# Altium project Dot_Matrix.PrjPcb
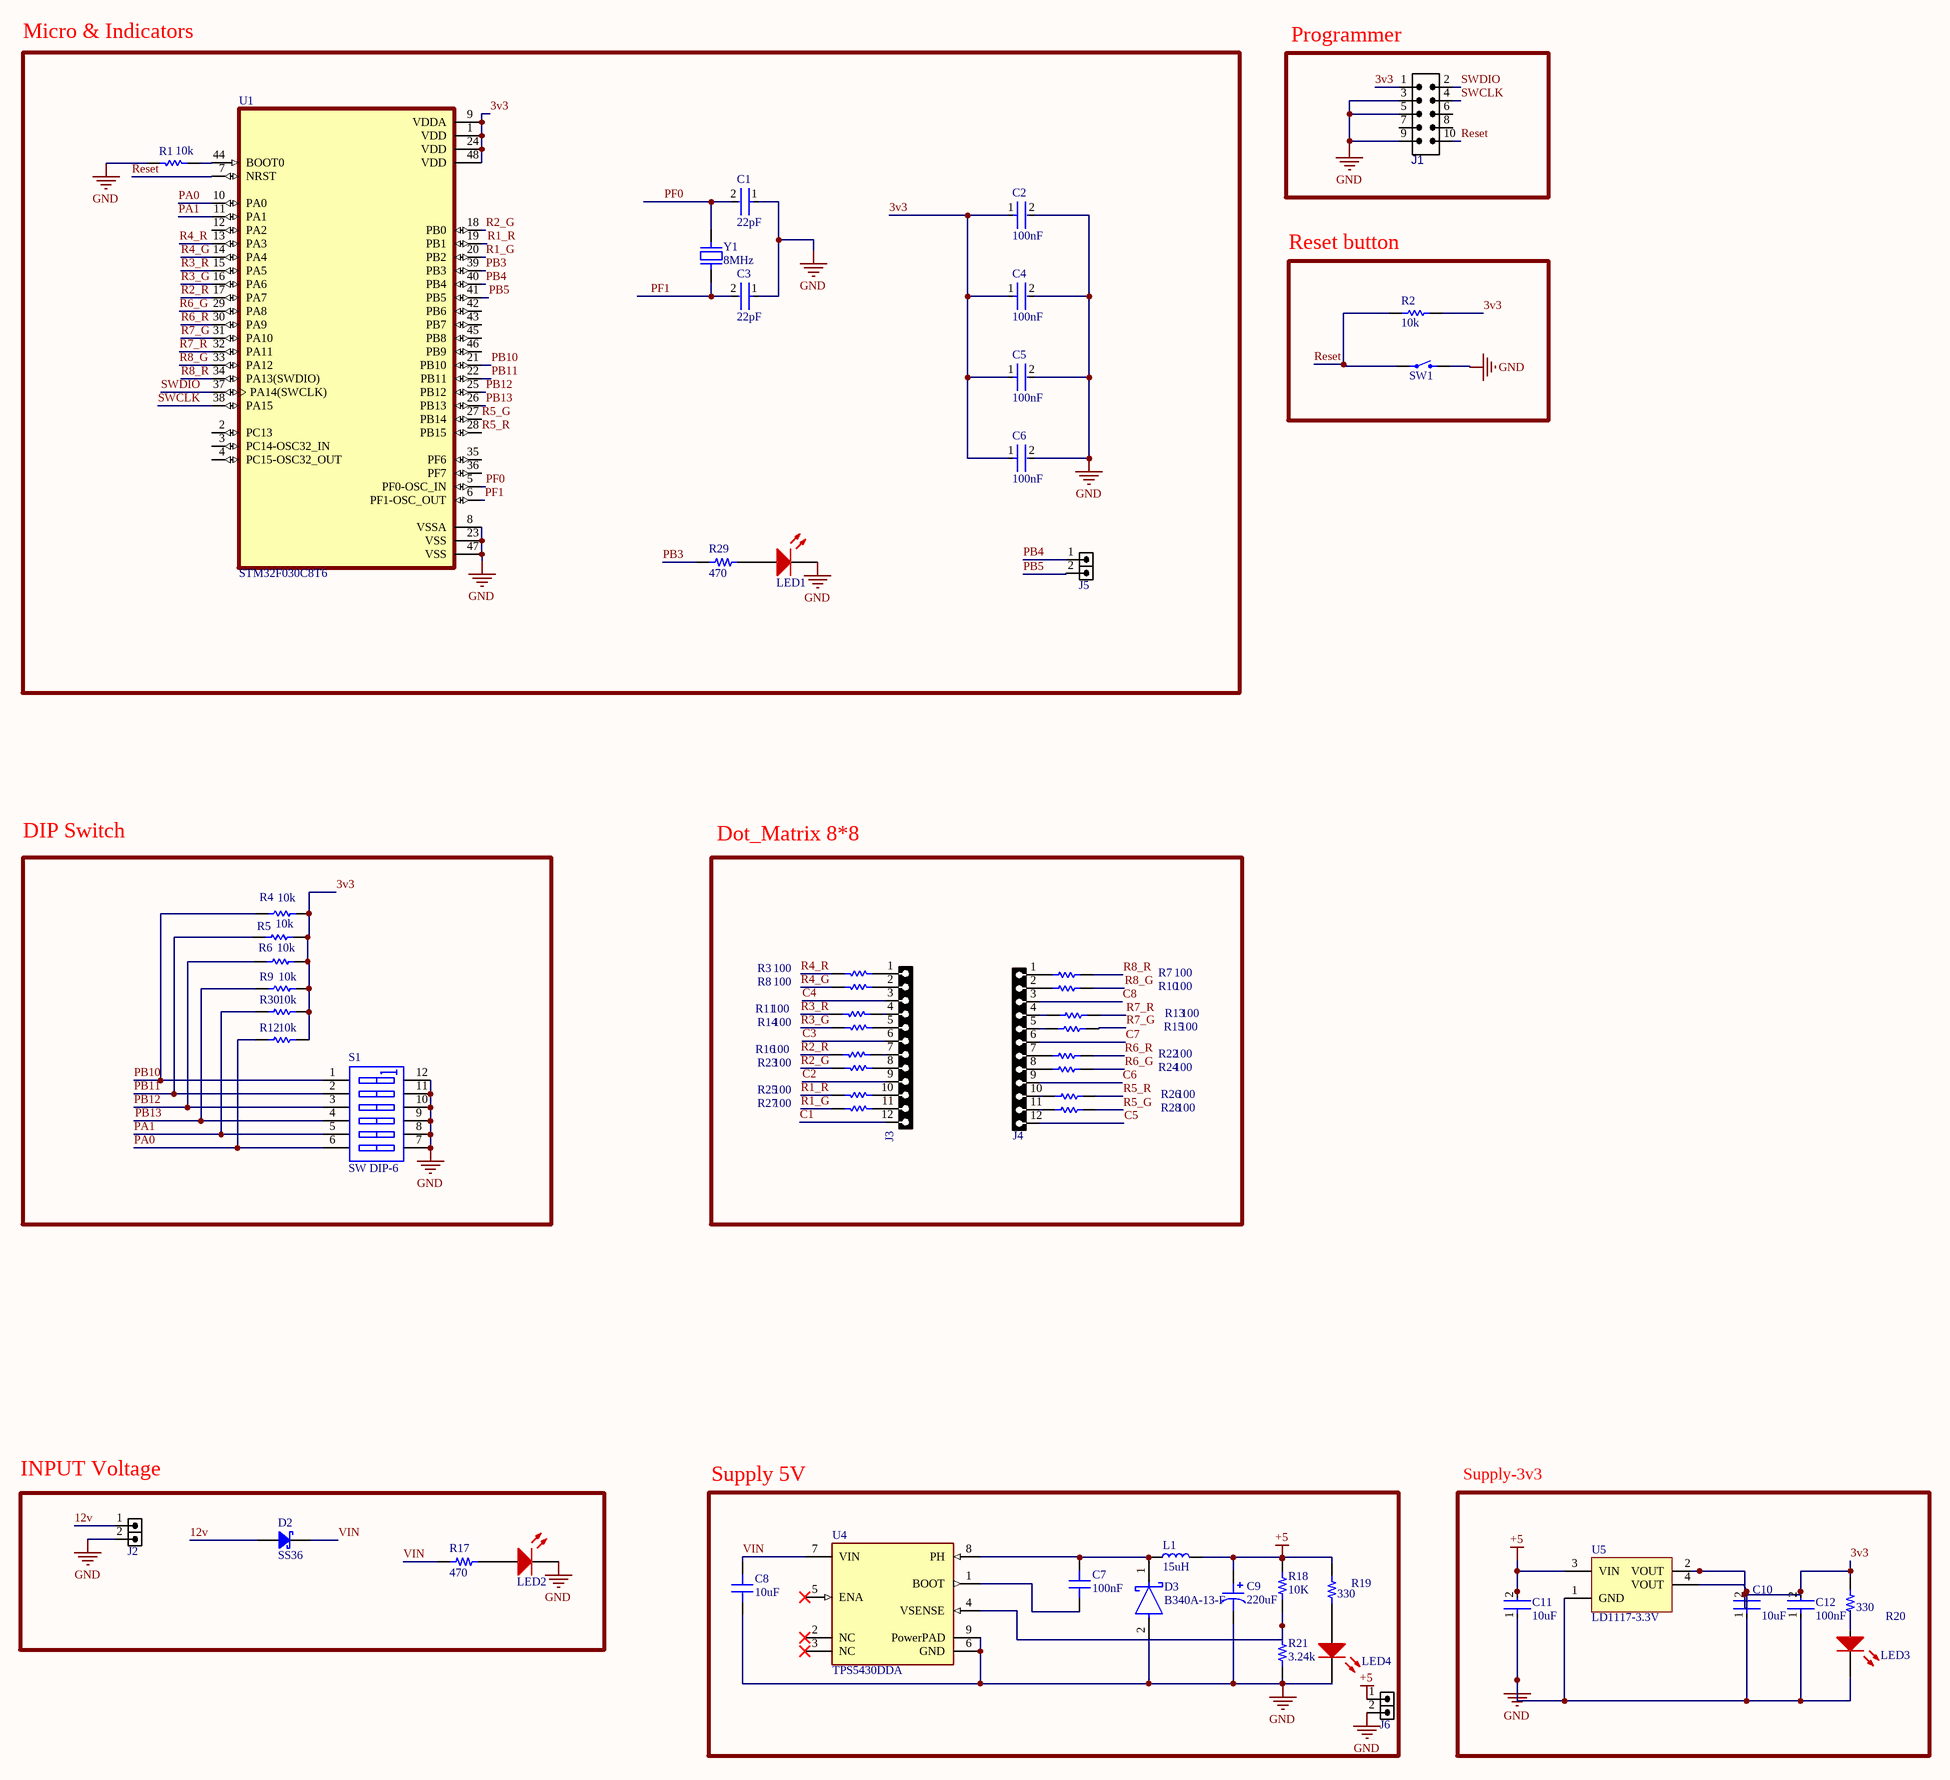
[diagram p0: Dot_Matrix.SchDoc]
1 sheet, 61 parts. Net scope: global (net labels, ports and power ports of the same name join across sheets).
Board file: Dot_Matrix.PcbDoc

## Sheet Dot_Matrix.SchDoc
size A2

### Parts
C1  22pF  [FP-C0805C-DN-MFG]
C2  100nF  [FP-C0805C-DN-MFG]
C3  22pF  [FP-C0805C-DN-MFG]
C4  100nF  [FP-C0805C-DN-MFG]
C5  100nF  [FP-C0805C-DN-MFG]
C6  100nF  [FP-C0805C-DN-MFG]
C7  100nF  [CAP 0805_2012]
C8  10uF  [CAP 0805_2012]
C9  220uF  [CAP TANSMD 1206_3216 CASE A]
C10  10uF  [FP-C0805C-DN-MFG]
C11  10uF  [FP-C0805C-DN-MFG]
C12  100nF  [FP-C0805C-DN-MFG]
D2  SS36  [DO-214AA SMB]
D3  B340A-13-F  [FP-SMA-MFG]
J1  IDC_2X5  [IDC_2X5]  (value not drawn)
J2  HDRM2  [HDR_1X2]  (value not drawn)
J3  HDRF12  [HDR_F_1X12]  (value not drawn)
J4  HDRF12  [HDR_F_1X12]  (value not drawn)
J5  HDRM2  [HDR_1X2]  (value not drawn)
J6  HDRM2  [HDR_1X2]  (value not drawn)
L1  15uH  [IND 0805_2012]
LED1  LED SMD 0805 RED  [LED_0805_RED]  (value not drawn)
LED2  LED SMD 0805 RED  [LED_0805_RED]  (value not drawn)
LED3  LED SMD 0805 RED  [LED_0805_RED]  (value not drawn)
LED4  LED SMD 0805 RED  [LED_0805_RED]  (value not drawn)
R1  10k  [RESC2013X60X35ML10T20]
R2  10k  [RESC2013X60X35ML10T20]
R3  100  [RESC2013X60X35ML10T20]
R4  10k  [RESC2013X60X35ML10T20]
R5  10k  [RESC2013X60X35ML10T20]
R6  10k  [RESC2013X60X35ML10T20]
R7  100  [RESC2013X60X35ML10T20]
R8  100  [RESC2013X60X35ML10T20]
R9  10k  [RESC2013X60X35ML10T20]
R10  100  [RESC2013X60X35ML10T20]
R11  100  [RESC2013X60X35ML10T20]
R12  10k  [RESC2013X60X35ML10T20]
R13  100  [RESC2013X60X35ML10T20]
R14  100  [RESC2013X60X35ML10T20]
R15  100  [RESC2013X60X35ML10T20]
R16  100  [RESC2013X60X35ML10T20]
R17  470  [RES 0805_2012]
R18  10K  [RES 0805_2012]
R19  330  [RES 0805_2012]
R20  330  [RES 0805_2012]
R21  3.24k  [RES 0805_2012]
R22  100  [RESC2013X60X35ML10T20]
R23  100  [RESC2013X60X35ML10T20]
R24  100  [RESC2013X60X35ML10T20]
R25  100  [RESC2013X60X35ML10T20]
R26  100  [RESC2013X60X35ML10T20]
R27  100  [RESC2013X60X35ML10T20]
R28  100  [RESC2013X60X35ML10T20]
R29  470  [RES 0805_2012]
R30  10k  [RESC2013X60X35ML10T20]
S1  SW DIP-6  [DIP-12/SW]
SW1  Tactile 2PIN 6X3.5mm H4.57mm (SMD)  [SWPBS_SPST_6X3X5]  (value not drawn)
U1  STM32F030C8T6  [QFP50P900X900X160-48N]
U4  TPS5430DDA  [FP-DDA0008J-MFG]
U5  LD1117-3.3V  [SOT-223-4 6.5X7MM P2.3MM]
Y1  8MHz  [HC-49S SMD]

### Blocks framed on the sheet
Micro & Indicators: C1-C6 J5 LED1 R1 R29 U1 Y1
Programmer: J1
Reset button: R2 SW1
DIP Switch: R4-R6 R9 R12 R30 S1
Dot_Matrix 8*8: J3 J4 R3 R7 R8 R10 R11 R13-R16 R22-R28
INPUT Voltage: D2 J2 LED2 R17
Supply 5V: C7-C9 D3 J6 L1 LED4 R18 R19 R21 U4
Supply-3v3: C10-C12 LED3 R20 U5

### Nets
+5: C9.1 C11.2 J6.1 L1.2 R18.2 R19.1 U5.3(VIN)
GND: C1.1 C2.2 C3.1 C4.2 C5.2 C6.2 C8.1 C9.2 C10.1 C11.1 C12.1 D3.2(A) J1.3 J1.5 J1.9 J2.2 J6.2 LED1.2(K) LED2.2(K) LED3.2(K) LED4.2(K) R1.1 R21.1 S1.7(B6) S1.8(B5) S1.9(B4) S1.10(B3) S1.11(B2) S1.12(B1) SW1.2 U1.8(VSSA) U1.23(VSS) U1.47(VSS) U4.6(GND) U4.9(PowerPAD) U5.1(GND)
3v3: C2.1 C4.1 C5.1 C6.1 C10.2 C12.2 J1.1 R2.1 R4.1 R5.1 R6.1 R9.1 R12.1 R20.1 R30.1 U1.1(VDD) U1.9(VDDA) U1.24(VDD) U1.48(VDD) U5.2(VOUT) U5.4(VOUT)
12v: D2.1 J2.1
C1: J3.12
C2: J3.9
C3: J3.6
C4: J3.3
C5: J4.12
C6: J4.9
C7: J4.6
C8: J4.3
PA0: R12.2 S1.6(A6) U1.10(PA0)
PA1: R30.2 S1.5(A5) U1.11(PA1)
PB3: R29.1 U1.39(PB3)
PB4: J5.1 U1.40(PB4)
PB5: J5.2 U1.41(PB5)
PB10: R4.2 S1.1(A1) U1.21(PB10)
PB11: R5.2 S1.2(A2) U1.22(PB11)
PB12: R6.2 S1.3(A3) U1.25(PB12)
PB13: R9.2 S1.4(A4) U1.26(PB13)
PF0: C1.2 U1.5(PF0-OSC_IN) Y1.2
PF1: C3.2 U1.6(PF1-OSC_OUT) Y1.1
R1_G: R27.1 U1.20(PB2)
R1_R: R25.1 U1.19(PB1)
R2_G: R23.1 U1.18(PB0)
R2_R: R16.1 U1.17(PA7)
R3_G: R14.1 U1.16(PA6)
R3_R: R11.1 U1.15(PA5)
R4_G: R8.1 U1.14(PA4)
R4_R: R3.1 U1.13(PA3)
R5_G: R28.1 U1.27(PB14)
R5_R: R26.1 U1.28(PB15)
R6_G: R24.1 U1.29(PA8)
R6_R: R22.1 U1.30(PA9)
R7_G: R15.1 U1.31(PA10)
R7_R: R13.1 U1.32(PA11)
R8_G: R10.1 U1.33(PA12)
R8_R: R7.1 U1.34(PA13(SWDIO))
Reset: J1.10 R2.2 SW1.1 U1.7(NRST)
SWCLK: J1.4 U1.38(PA15)
SWDIO: J1.2 U1.37(PA14(SWCLK))
VIN: C8.2 D2.2 R17.1 U4.7(VIN)
NetC7_1: C7.1 U4.1(BOOT)
NetC7_2: C7.2 D3.1(C) L1.1 U4.8(PH)
NetJ3_1: J3.1 R3.2
NetJ3_2: J3.2 R8.2
NetJ3_4: J3.4 R11.2
NetJ3_5: J3.5 R14.2
NetJ3_7: J3.7 R16.2
NetJ3_8: J3.8 R23.2
NetJ3_10: J3.10 R25.2
NetJ3_11: J3.11 R27.2
NetJ4_1: J4.1 R7.2
NetJ4_2: J4.2 R10.2
NetJ4_4: J4.4 R13.2
NetJ4_5: J4.5 R15.2
NetJ4_7: J4.7 R22.2
NetJ4_8: J4.8 R24.2
NetJ4_10: J4.10 R26.2
NetJ4_11: J4.11 R28.2
NetLED1_1: LED1.1(A) R29.2
NetLED2_1: LED2.1(A) R17.2
NetLED3_1: LED3.1(A) R20.2
NetLED4_1: LED4.1(A) R19.2
NetR1_2: R1.2 U1.44(BOOT0)
NetR18_1: R18.1 R21.2 U4.4(VSENSE)

Not connected (* = marked no-connect by the designer): J1 6 7 8; U1 2(PC13) 3(PC14-OSC32_IN) 4(PC15-OSC32_OUT) 12(PA2) 35(PF6) 36(PF7) 42(PB6) 43(PB7) 45(PB8) 46(PB9); U4 2(NC)* 3(NC)* 5(ENA)*

### Notes on the sheet
- Title
- Size:
- Date:
- File:
- A2
- Number:
- Time:
- Revision:
- Sheet
- of

### Library data of the parts
C1-C6 C10-C12 = CMP-1036-04552-2: CAP CER 0.22UF 50V X7R 0805; Manufacturer: KEMET; Manufacturer Part Number: C0805C224K5RACTU; Value: 0.22 μF; Temperature Coefficient: 30ppm/°C; Material: Ceramic; Tolerance: 0.1; ComponentLink2URL: https://content.kemet.com/datasheets/KEM_C1003_C0G_SMD.pdf; Temperature Characteristic: X7R; Device Class L3: Ceramic Capacitors; Lead Free: Yes; Temperature: -55°C to +125°C; RoHS: TRUE; Capacitance: 0.22 μF; Automotive: No; Octopart: https://octopart.com/c0805c224k5ractu-kemet-144670; Temperature Range Low: -55°C; Height: 0.88mm; Device Class L1: Passive Components; Digikey Description: CAP CER 0.22UF 50V X7R 0805; ComponentLink2Description: Datasheet; Mouser Description: CAP CER 0.22UF 50V X7R 0805; Category: Cap; Ipc Land Pattern Name: CAPC200125X78; Temperature Range High: +125°C; Package: C0805C-DN; Device Class L2: Capacitors; Voltage Rating: 50 V
C7 = Cap 0805: SMT Capacitor; VALUE: 100nF
C8 = Cap 0805: SMT Capacitor; VALUE: 100nF
C9 = Cap Tan Case A: SMT Tantalum Capacitor; VALUE: 10uF 6.3V
D2 = SS36 (SMD SMC): Diode Schottky 60V 3A Surface Mount DO-214AB (SMC); PartNumber: SS36-E3/57T
D3 = CMP-1667-00003-3: DIODE SCHOTTKY 40V 3A SMA; Max Forward Surge Current (Ifsm): 80A; Forward Voltage: 500mV; Polarity: Standard; Max Reverse Current: 500uA; Capacitance: 250pF; Element Configuration: Single; Mount: Surface Mount; Output Current: 3A; Radiation Hardening: No; Width: 2.92mm; Current Rating: 3A; Termination: SMD/SMT; Voltage: 40V; Series: -; Max Operating Temperature: 125°C; Current: 3A; Max Repetitive Reverse Voltage (Vrrm): 40V; Min Operating Temperature: -55°C; REACH SVHC: No SVHC; Number of Pins: 2; Average Rectified Current: 3A; Contact Plating: Tin; RoHS Compliant: Yes; Max Reverse Voltage (DC): 40V; Packaging: Tape and Reel; Height: 2.3mm; Length: 4.6mm; Case/Package: SMA; Weight: 0.002258oz; Peak Non-Repetitive Surge Current: 80A; Package Quantity: 5000; Lead Free: Lead Free; Forward Current: 3A; Voltage Rating (DC): 40V
J1 = IDC_2X5: CONN, IDC, Male, pitch: 2.54mm, 10POS; VALUE: IDC_2X5
J2 J5 J6 = HDR_1X2: CONN, HEADER, Male, pitch: 2.54mm, 2POS; VALUE: HDRM2
J3 J4 = HDR_F_1X12: CONN, HEADER, Female, pitch: 2.54mm, 12POS; VALUE: HDRF12
L1 = Ind 0805: SMT Inductor; Value: 15uH
R1-R16 R22-R28 R30 = CMP-2100-03673-1: Chip Resistor, 0 Ohm, Jumper, +/- 5%, 0.125 W, -55 to 155 degC, 0805 (2012 Metric), RoHS, Tape and Reel; Manufacturer: Yageo; Power Rating: 125mW; Resistance: 0mOhm; Voltage Rating (DC): 150V; Temperature Coefficient: 200ppm/degreesC; Height: 0.5mm; Depth: 1.25mm; Case Code (Imperial): 0805; Lead Free: LeadFree; Military Standard: Not; Package Description: 2-Pin Surface Mounted Device, Body 2 x 1.25 mm; Case Code (Metric): 2012; Composition: ThickFilm; Voltage Rating: 150V; Manufacturer URL: http://www.yageo.com/; Packaging: TapeandReel; Package Reference: 0805; REACH SVHC: Unknown; Tolerance: 5%; Case/Package: 0805; Max Operating Temperature: 155degC; Number of Pins: 2; Min Operating Temperature: -55degC; RoHSCompliant: true; Length: 2mm; Datasheet URL: http://www.yageo.com/NewPortal/yageodocoutput?fileName=/pdf/R-Chip/PYu-RC_Group_51_RoHS_L_5.pdf; Termination: SMD/SMT; Radiation Hardening: No; Width: 1.25mm; Contact Plating: Tin; Datasheet Version: Rev. 5, 10/2016
R17-R21 R29 = Res 0805: SMT Resistor; VALUE: 1K
S1 = SW DIP-6: DIP Switch, 6 Position, SPST; Published: 24-Mar-1999; LatestRevisionDate: 17-Jul-2002; LatestRevisionNote: Re-released for DXP Platform.; PackageReference: DIP-12/SW; Publisher: Altium Limited; PackageDescription: DIP Switch; 12 Leads
SW1 = Tactile 2PIN 6X3.5mm H4.57mm (SMD): Tactile Switch SPST-NO Top Actuated Surface Mount; PartNumber: FSMSMTR-ND
U1 = STM32F030C8T6: STM32F Series 32-bit 64 kB Flash 8 kB RAM ARM Based Microcontroller - LQFP-48; Value: *; Availability: Unavailable; Price: None; MP: STM32F030C8T6; Package: None
U4 = CMP-2000-04960-2: IC REG BUCK ADJUSTABLE 3A 8SOPWR; Manufacturer: Texas Instruments; Max Junction Temp: +125°C; Max Supply Voltage: 36V; Switching Frequency: 500kHz; Output Type: AdjustableProgrammable; Standoff Height: 0mm; Output Voltage: 1.23-31V; Max Duty Cycle: 89%; Nominal Supply Current: 3mA; Min Supply Voltage: 5.5V; Number Of Outputs: 1; Temperature: -40°C to +125°C; Temperature Range High: +125°C; Manufacturer Part Number: TPS5430DDA; Device Class L3: Voltage Regulators - Switching; Mouser Description: Voltage Regulators - Switching Regulators 5.5 to 36V Input 3A Step Dwn Converter; Switching Topology: Buck; ComponentLink2URL: http://www.ti.com/lit/ds/symlink/tps5431.pdf; ComponentLink2Description: Datasheet; Device Class L2: Power Management ICs; Device Class L1: Integrated Circuits (ICs); Digikey Description: IC REG BUCK ADJUSTABLE 3A 8SOPWR; RoHS: TRUE; Octopart: https://octopart.com/tps5430dda-texas+instruments-589977; Output Current: 3A; Automotive: No; Lead Free: Yes; Category: IC; Package: DDA0008J; Temperature Range Low: -40°C; Height: 1.7mm
U5 = LD1117-3.3V (SMD SOT-223): Linear Voltage Regulator IC  1 Output  800mA SOT-223; PartNumber: LD1117S33CTR
Y1 = Crystal HC-49S SMD 8MHz: SMT Crystal; PartNumber: ABLS-8.000MHZ-K4T